# Altium project comparator_mezzanine.PrjPcb
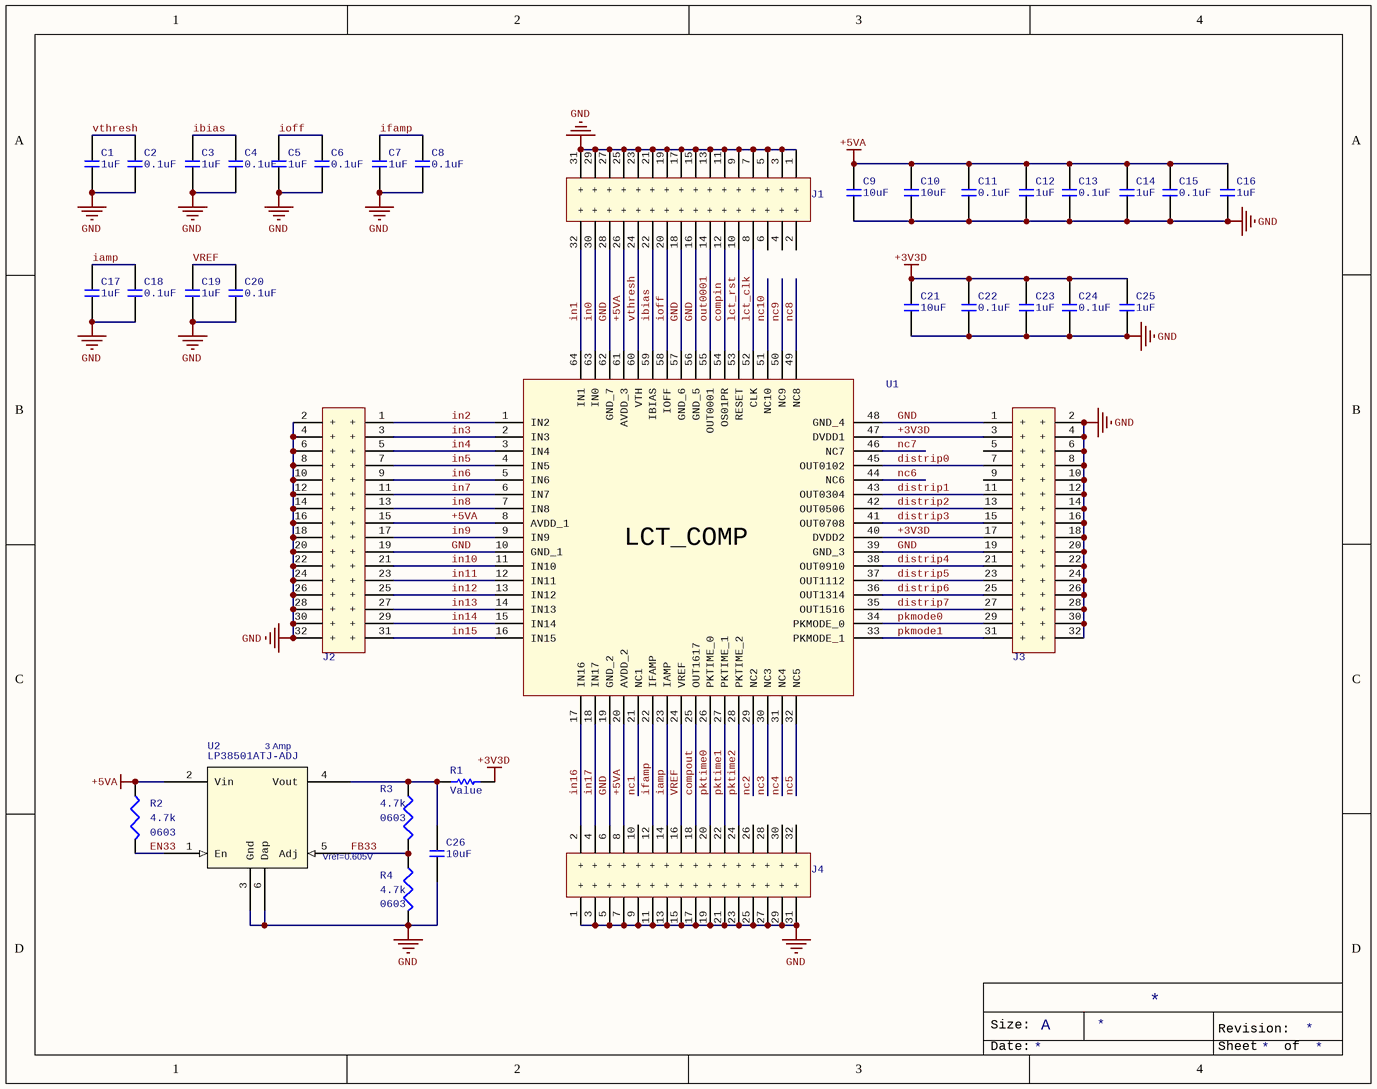
[diagram p0: comparator_mezzanine.SchDoc]
1 sheet, 36 parts. Net scope: global (net labels, ports and power ports of the same name join across sheets).
Board file: comparator_mezzanine.PcbDoc

## Sheet comparator_mezzanine.SchDoc
size A

### Parts
C1  1uF  [C0603]
C2  0.1uF  [C0603]
C3  1uF  [C0603]
C4  0.1uF  [C0603]
C5  1uF  [C0603]
C6  0.1uF  [C0603]
C7  1uF  [C0603]
C8  0.1uF  [C0603]
C9  10uF  [c1206]
C10  10uF  [c1206]
C11  0.1uF  [C0603]
C12  1uF  [C0603]
C13  0.1uF  [C0603]
C14  1uF  [C0603]
C15  0.1uF  [C0603]
C16  1uF  [C0603]
C17  1uF  [C0603]
C18  0.1uF  [C0603]
C19  1uF  [C0603]
C20  0.1uF  [C0603]
C21  10uF  [c1206]
C22  0.1uF  [C0603]
C23  1uF  [C0603]
C24  0.1uF  [C0603]
C25  1uF  [C0603]
C26  10uF  [c1206]
J1  HEADER 16x02  [HEADER 16X02]  (value not drawn)
J2  HEADER 16x02  [HEADER 16X02]  (value not drawn)
J3  HEADER 16x02  [HEADER 16X02]  (value not drawn)
J4  HEADER 16x02  [HEADER 16X02]  (value not drawn)
R1  Value  [R1206]
R2  4.7k  Supplier Device Package: 0603  [MC_S6/SM/R_0603_IPC]
R3  4.7k  Supplier Device Package: 0603  [MC_S6/SM/R_0603_IPC]
R4  4.7k  Supplier Device Package: 0603  [MC_S6/SM/R_0603_IPC]
U1  UCLA/LCT_COMP  [TQFP-64 14x14mm]  (value not drawn)
U2  LP38501ATJ-ADJ  [MC_S6/SM/TO263_THIN]

### Nets
+3V3D: C21.1 C22.2 C23.2 C24.2 C25.2 J3.3(+) J3.17(+) R1.2 U1.40(DVDD2) U1.47(DVDD1)
+5VA: C9.1 C10.1 C11.2 C12.2 C13.2 C14.2 C15.2 C16.2 J1.26(+) J2.15(+) J4.8(+) R2.1 U1.8(AVDD_1) U1.20(AVDD_2) U1.61(AVDD_3) U2.2(Vin)
GND: C1.1 C2.1 C3.1 C4.1 C5.1 C6.1 C7.1 C8.1 C9.2 C10.2 C11.1 C12.1 C13.1 C14.1 C15.1 C16.1 C17.1 C18.1 C19.1 C20.1 C21.2 C22.1 C23.1 C24.1 C25.1 C26.2 J1.1(+) J1.3(+) J1.5(+) J1.7(+) J1.9(+) J1.11(+) J1.13(+) J1.15(+) J1.16(+) J1.17(+) J1.18(+) J1.19(+) J1.21(+) J1.23(+) J1.25(+) J1.27(+) J1.28(+) J1.29(+) J1.31(+) J2.2(+) J2.4(+) J2.6(+) J2.8(+) J2.10(+) J2.12(+) J2.14(+) J2.16(+) J2.18(+) J2.19(+) J2.20(+) J2.22(+) J2.24(+) J2.26(+) J2.28(+) J2.30(+) J2.32(+) J3.1(+) J3.2(+) J3.4(+) J3.6(+) J3.8(+) J3.10(+) J3.12(+) J3.14(+) J3.16(+) J3.18(+) J3.19(+) J3.20(+) J3.22(+) J3.24(+) J3.26(+) J3.28(+) J3.30(+) J3.32(+) J4.1(+) J4.3(+) J4.5(+) J4.6(+) J4.7(+) J4.9(+) J4.11(+) J4.13(+) J4.15(+) J4.17(+) J4.19(+) J4.21(+) J4.23(+) J4.25(+) J4.27(+) J4.29(+) J4.31(+) R4.2 U1.10(GND_1) U1.19(GND_2) U1.39(GND_3) U1.48(GND_4) U1.56(GND_5) U1.57(GND_6) U1.62(GND_7) U2.3(Gnd) U2.6(Dap)
compin: J1.12(+) U1.54(OS01PR)
compout: J4.18(+) U1.25(OUT1617)
distrip0: J3.7(+) U1.45(OUT0102)
distrip1: J3.11(+) U1.43(OUT0304)
distrip2: J3.13(+) U1.42(OUT0506)
distrip3: J3.15(+) U1.41(OUT0708)
distrip4: J3.21(+) U1.38(OUT0910)
distrip5: J3.23(+) U1.37(OUT1112)
distrip6: J3.25(+) U1.36(OUT1314)
distrip7: J3.27(+) U1.35(OUT1516)
EN33: R2.2 U2.1(En)
FB33: R3.2 R4.1 U2.5(Adj)
iamp: C17.2 C18.2 J4.14(+) U1.23(IAMP)
ibias: C3.2 C4.2 J1.22(+) U1.59(IBIAS)
ifamp: C7.2 C8.2 J4.12(+) U1.22(IFAMP)
in0: J1.30(+) U1.63(IN0)
in1: J1.32(+) U1.64(IN1)
in2: J2.1(+) U1.1(IN2)
in3: J2.3(+) U1.2(IN3)
in4: J2.5(+) U1.3(IN4)
in5: J2.7(+) U1.4(IN5)
in6: J2.9(+) U1.5(IN6)
in7: J2.11(+) U1.6(IN7)
in8: J2.13(+) U1.7(IN8)
in9: J2.17(+) U1.9(IN9)
in10: J2.21(+) U1.11(IN10)
in11: J2.23(+) U1.12(IN11)
in12: J2.25(+) U1.13(IN12)
in13: J2.27(+) U1.14(IN13)
in14: J2.29(+) U1.15(IN14)
in15: J2.31(+) U1.16(IN15)
in16: J4.2(+) U1.17(IN16)
in17: J4.4(+) U1.18(IN17)
ioff: C5.2 C6.2 J1.20(+) U1.58(IOFF)
lct_clk: J1.8(+) U1.52(CLK)
lct_rst: J1.10(+) U1.53(RESET)
nc1: U1.21(NC1)
nc2: U1.29(NC2)
nc3: U1.30(NC3)
nc4: U1.31(NC4)
nc5: U1.32(NC5)
nc6: U1.44(NC6)
nc7: U1.46(NC7)
nc8: U1.49(NC8)
nc9: U1.50(NC9)
nc10: U1.51(NC10)
out0001: J1.14(+) U1.55(OUT0001)
pkmode0: J3.29(+) U1.34(PKMODE_0)
pkmode1: J3.31(+) U1.33(PKMODE_1)
pktime0: J4.20(+) U1.26(PKTIME_0)
pktime1: J4.22(+) U1.27(PKTIME_1)
pktime2: J4.24(+) U1.28(PKTIME_2)
VREF: C19.2 C20.2 J4.16(+) U1.24(VREF)
vthresh: C1.2 C2.2 J1.24(+) U1.60(VTH)
NetC26_1: C26.1 R1.1 R3.1 U2.4(Vout)

Not connected (* = marked no-connect by the designer): J1 2(+) 4(+) 6(+); J3 5(+) 9(+); J4 10(+) 26(+) 28(+) 30(+) 32(+)

### Notes on the sheet
- (near U2) 3 Amp
- (near U2) Vref=0.605V
- Size:
- A
- Revision:
- Date:
- Sheet
- of
- (in symbol UCLA/LCT_COMP) LCT_COMP

### Library data of the parts
C1 C3 C5 C7 C12 C14 C16 C17 C19 C23 C25 = Murata/GRM188R61E105KA12D: CAP2, CER, 1.0uF, 10%, 25V, 0603
C2 C4 C6 C8 C11 C13 C15 C18 C20 C22 C24 = CAP/06035C104KAT2A: CAP-CER, 2, 0.1uF, 10%, 50V, 0603, X7R; Manufacturer: AVX Corporation; Capacitance: 0.10µF; Supplier 1: Digi-Key; Manufacturer Part Number: 06035C104KAT2A; RoHS: RoHS Compliant; Category: Capacitors; Stock 1: 4412408; Pricing 1: 1=0.1, 10=0.036, 25=0.0264, 50=0.0198, 100=0.0162, 250=0.01352, 500=0.01156, 1000=0.00908 (USD); Packaging: Cut Tape (CT); Tolerance: ±10%; Voltage - Rated: 50V; Temperature Coefficient: X7R; Mounting Type: Surface Mount, MLCC; Operating Temperature: -55°C ~ 125°C; Applications: General Purpose; Ratings: -; Package / Case: 0603 (1608 Metric); Size / Dimension: 0.063" L x 0.032" W (1.60mm x 0.81mm); Height - Seated (Max): -; Thickness (Max): 0.035" (0.90mm); Lead Spacing: -; Features: -; Lead Style: -; ComponentLink1URL: http://datasheets.avx.com/X7RDielectric.pdf; ComponentLink1Description: http://datasheets.avx.com/X7RDielectric.pdf; Supplier 2: Newark; Supplier Part Number 1: 478-5052-1-ND; Supplier Part Number 2: 54K2412
C9 C10 C21 C26 = CAP/GMK316F106ZL-T: CAP-CER, 2, 10uF, 10%, 35V, 1206; Manufacturer: Taiyo Yuden; Capacitance: 10µF; Tolerance: -20%, +80%; Temperature Coefficient: Y5V (F); Supplier 1: Digi-Key; Supplier Part Number 1: 587-1352-1-ND; Manufacturer Part Number: GMK316F106ZL-T; RoHS: RoHS Compliant; Category: Capacitors; Stock 1: 249989; Pricing 1: 1=0.46, 10=0.345, 50=0.2012, 100=0.161, 250=0.115, 500=0.0782, 1000=0.06325 (USD); Packaging: Cut Tape (CT); Voltage - Rated: 35V; Mounting Type: Surface Mount, MLCC; Operating Temperature: -30°C ~ 85°C; Applications: General Purpose; Ratings: -; Package / Case: 1206 (3216 Metric); Size / Dimension: 0.126" L x 0.063" W (3.20mm x 1.60mm); Height - Seated (Max): -; Thickness (Max): 0.071" (1.80mm); Lead Spacing: -; Features: -; Lead Style: -; ComponentLink1URL: http://ds.yuden.co.jp/TYCOMPAS/ut/detail.do?productNo=GMK316F106ZL-T&fileName=GMK316F106ZL-T_SS&mode=specSheetDownload; ComponentLink1Description: http://ds.yuden.co.jp/TYCOMPAS/ut/detail.do?productNo=GMK316F106ZL-T&fileName=GMK316F106ZL-T_SS&mode=specSheetDownload
R1 = RES SMD Generic 1206: RES0, SMD 1206
R2-R4 = ERJ-3EKF4701V: RES SMD 4.7K OHM 1% 1/10W 0603; Manufacturer: Panasonic Electronic Components; Power (Watts): 0.1W, 1/10W; Temperature Coefficient: ±100ppm/°C; Tolerance: ±1%; Supplier 1: Digi-Key; Manufacturer Part Number: ERJ-3EKF4701V; RoHS: RoHS Compliant; Category: Resistors; Stock 1: 998330; Pricing 1: 1=0.1, 50=0.0114, 100=0.0084, 250=0.00644, 500=0.00514, 1000=0.00379 (USD); Packaging: Cut Tape (CT); Part Status: Active; Resistance (Ohms): 4.7k; Composition: Thick Film; Features: Automotive AEC-Q200; Operating Temperature: -55°C ~ 155°C; Package / Case: 0603 (1608 Metric); Size / Dimension: 0.063" L x 0.031" W (1.60mm x 0.80mm); Height - Seated (Max): 0.022" (0.55mm); Number of Terminations: 2; Failure Rate: -; ComponentLink1URL: http://industrial.panasonic.com/www-cgi/jvcr13pz.cgi?E+PZ+3+AOA0002+ERJ3EKF4701V+7+WW; ComponentLink1Description: http://industrial.panasonic.com/www-cgi/jvcr13pz.cgi?E+PZ+3+AOA0002+ERJ3EKF4701V+7+WW; Supplier 2: Digi-Key; Stock 2: 998330; Pricing 2: 1=0.1, 50=0.0114, 100=0.0084, 250=0.00644, 500=0.00514, 1000=0.00379 (USD); Supplier Part Number 1: P4.70KHCT-ND; Supplier Part Number 2: P4.70KHDKR-ND
U1 = UCLA/LCT_COMP: UCLA LCT Comparator
U2 = LP38501ATJ-ADJ: COMPSIDE: TOP; COMPGROUP: 0; mfgr: National; mfgr_foot: TO-263-THIN; COMPROT: 0; mfgr_id: LP38501ATJ-ADJ; Package: 000